# Altium schematic sheet Sheet1.SchDoc
size A; SheetNumber: 1; SheetTotal: 2
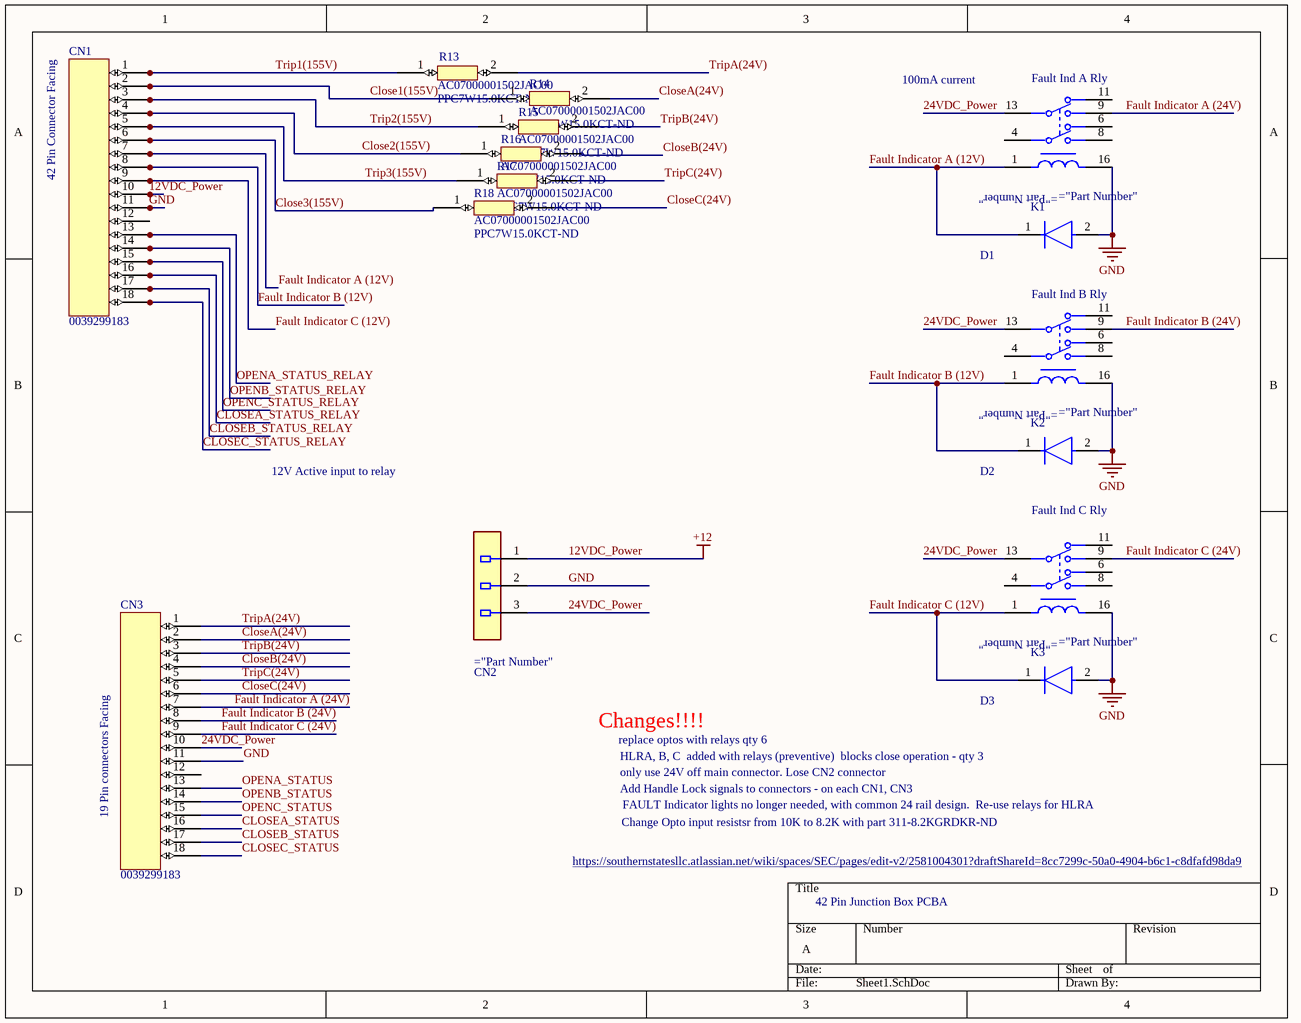
[diagram p0: Sheet1.SchDoc]

## Parts
CN1  0039299183  [0039299183]
CN2  15-31-1036  [Molex_15-31-1036_0]  (value not drawn)
CN3  0039299183  [0039299183]
D1  S1A-13-F  [Micro_Commercial_DO-214AC_MFG]  (value not drawn)
D2  S1A-13-F  [Micro_Commercial_DO-214AC_MFG]  (value not drawn)
D3  S1A-13-F  [Micro_Commercial_DO-214AC_MFG]  (value not drawn)
K1  DS2Y-S-DC24V  [Panasonic_DS2Y-S-DC24V_0]  (value not drawn)
K2  DS2Y-S-DC24V  [Panasonic_DS2Y-S-DC24V_0]  (value not drawn)
K3  DS2Y-S-DC24V  [Panasonic_DS2Y-S-DC24V_0]  (value not drawn)
R13  AC07000001502JAC00  Supplier Part Number 1: PPC7W15.0KCT-ND  [AC07000001502JAC00]
R14  AC07000001502JAC00  Supplier Part Number 1: PPC7W15.0KCT-ND  [AC07000001502JAC00]
R15  AC07000001502JAC00  Supplier Part Number 1: PPC7W15.0KCT-ND  [AC07000001502JAC00]
R16  AC07000001502JAC00  Supplier Part Number 1: PPC7W15.0KCT-ND  [AC07000001502JAC00]
R17  AC07000001502JAC00  Supplier Part Number 1: PPC7W15.0KCT-ND  [AC07000001502JAC00]
R18  AC07000001502JAC00  Supplier Part Number 1: PPC7W15.0KCT-ND  [AC07000001502JAC00]

## Nets
12VDC_Power: CN1.10 CN2.1  [also labelled +12]
GND: CN1.11 CN2.2 CN3.11 D1.2(A) D2.2(A) D3.2(A) K1.16(-) K2.16(-) K3.16(-)
24VDC_Power: CN2.3 CN3.10 K1.13(2_COM) K2.13(2_COM) K3.13(2_COM)
Close1(155V): CN1.2 R14.1
Close2(155V): CN1.4 R16.1
Close3(155V): CN1.6 R18.1
CloseA(24V): CN3.2 R14.2
CLOSEA_STATUS: CN3.16
CLOSEA_STATUS_RELAY: CN1.16
CloseB(24V): CN3.4 R16.2
CLOSEB_STATUS: CN3.17
CLOSEB_STATUS_RELAY: CN1.17
CloseC(24V): CN3.6 R18.2
CLOSEC_STATUS: CN3.18
CLOSEC_STATUS_RELAY: CN1.18
Fault Indicator A (12V): CN1.7 D1.1(C) K1.1(+)
Fault Indicator A (24V): CN3.7 K1.9(2_N.O.)
Fault Indicator B (12V): CN1.8 D2.1(C) K2.1(+)
Fault Indicator B (24V): CN3.8 K2.9(2_N.O.)
Fault Indicator C (12V): CN1.9 D3.1(C) K3.1(+)
Fault Indicator C (24V): CN3.9 K3.9(2_N.O.)
OPENA_STATUS: CN3.13
OPENA_STATUS_RELAY: CN1.13
OPENB_STATUS: CN3.14
OPENB_STATUS_RELAY: CN1.14
OPENC_STATUS: CN3.15
OPENC_STATUS_RELAY: CN1.15
Trip1(155V): CN1.1 R13.1
Trip2(155V): CN1.3 R15.1
Trip3(155V): CN1.5 R17.1
TripA(24V): CN3.1 R13.2
TripB(24V): CN3.3 R15.2
TripC(24V): CN3.5 R17.2

Not connected (* = marked no-connect by the designer): CN1 12; CN3 12; K1 4(1_COM) 6(1_N.C.) 8(1_N.O.) 11(2_N.C.); K2 4(1_COM) 6(1_N.C.) 8(1_N.O.) 11(2_N.C.); K3 4(1_COM) 6(1_N.C.) 8(1_N.O.) 11(2_N.C.)

## Notes on the sheet
- (near K1) 100mA current
- (near K1) Fault Ind A Rly
- (near CN1) 42 Pin Connector Facing
- (near K2) Fault Ind B Rly
- 12V Active input to relay
- (near K3) Fault Ind C Rly
- Changes!!!!
- replace optos with relays qty 6
- HLRA, B, C  added with relays (preventive)  blocks close operation - qty 3
- only use 24V off main connector. Lose CN2 connector
- (near CN3) 19 Pin connectors Facing
- Add Handle Lock signals to connectors - on each CN1, CN3
- Change Opto input resistsr from 10K to 8.2K with part 311-8.2KGRDKR-ND
- FAULT Indicator lights no longer needed, with common 24 rail design.  Re-use relays for HLRA
- https://southernstatesllc.atlassian.net/wiki/spaces/SEC/pages/edit-v2/2581004301?draftShareId=8cc7299c-50a0-4904-b6c1-c8dfafd98da9
- 42 Pin Junction Box PCBA

## Library data of the parts
CN1 CN3 = 0039299183 - 18 pin molex mini fit jr 5566: Connector Header Through Hole 18 position 0.165" (4.20mm)
D1-D3 = FM2000GP
R13-R18 = AC07000001502JAC00: Manufacturer: Vishay BCcomponents; Tolerance: 5%; Power Rating: 7W; Resistance: 15kR; Temperature Coefficient: 180ppm/°C; Voltage Rating: 324V; Supplier 1: Digi-Key; Manufacturer Part Number: AC07000001502JAC00; Stock 1: 0; Pricing 1: 1=2.26, 10=2.002, 25=1.8564, 50=1.7472, 100=1.5288, 250=1.3104 (USD); Mount: Through Hole; Case/Package: Axial; Number of Pins: 2; Contact Plating: Tin; Min Operating Temperature: -40°C; Max Operating Temperature: 275°C; Resistor Type: Wirewound; Package Quantity: 1; Packaging: Tape and Reel; Number of Terminations: 2; Max Power Dissipation: 7W; Voltage Rating (DC): 324V; Termination: Axial; Features: Flame Retardant Coating; Series: AC; Resistance Tolerance: 5%; Diameter: 7.5mm; Length: 1.024inch; Width: 7.49mm; Radiation Hardening: No; RoHS Compliant: Yes; ComponentLink1URL: http://www.vishay.com/docs/28730/acseries.pdf?src-supplier=Avnet; ComponentLink1Description: http://www.vishay.com/docs/28730/acseries.pdf?src-supplier=Avnet; ComponentLink2URL: http://www.vishay.com/docs/28730/acseries.pdf?src-supplier=Avnet+Europe; ComponentLink2Description: http://www.vishay.com/docs/28730/acseries.pdf?src-supplier=Avnet+Europe; ComponentLink3URL: http://www.vishay.com/docs/28730/acac-at.pdf?src-supplier=Digi-Key; ComponentLink3Description: http://www.vishay.com/docs/28730/acac-at.pdf?src-supplier=Digi-Key